# EAGLE schematic LEDPanel (EAGLE 9.6.2)
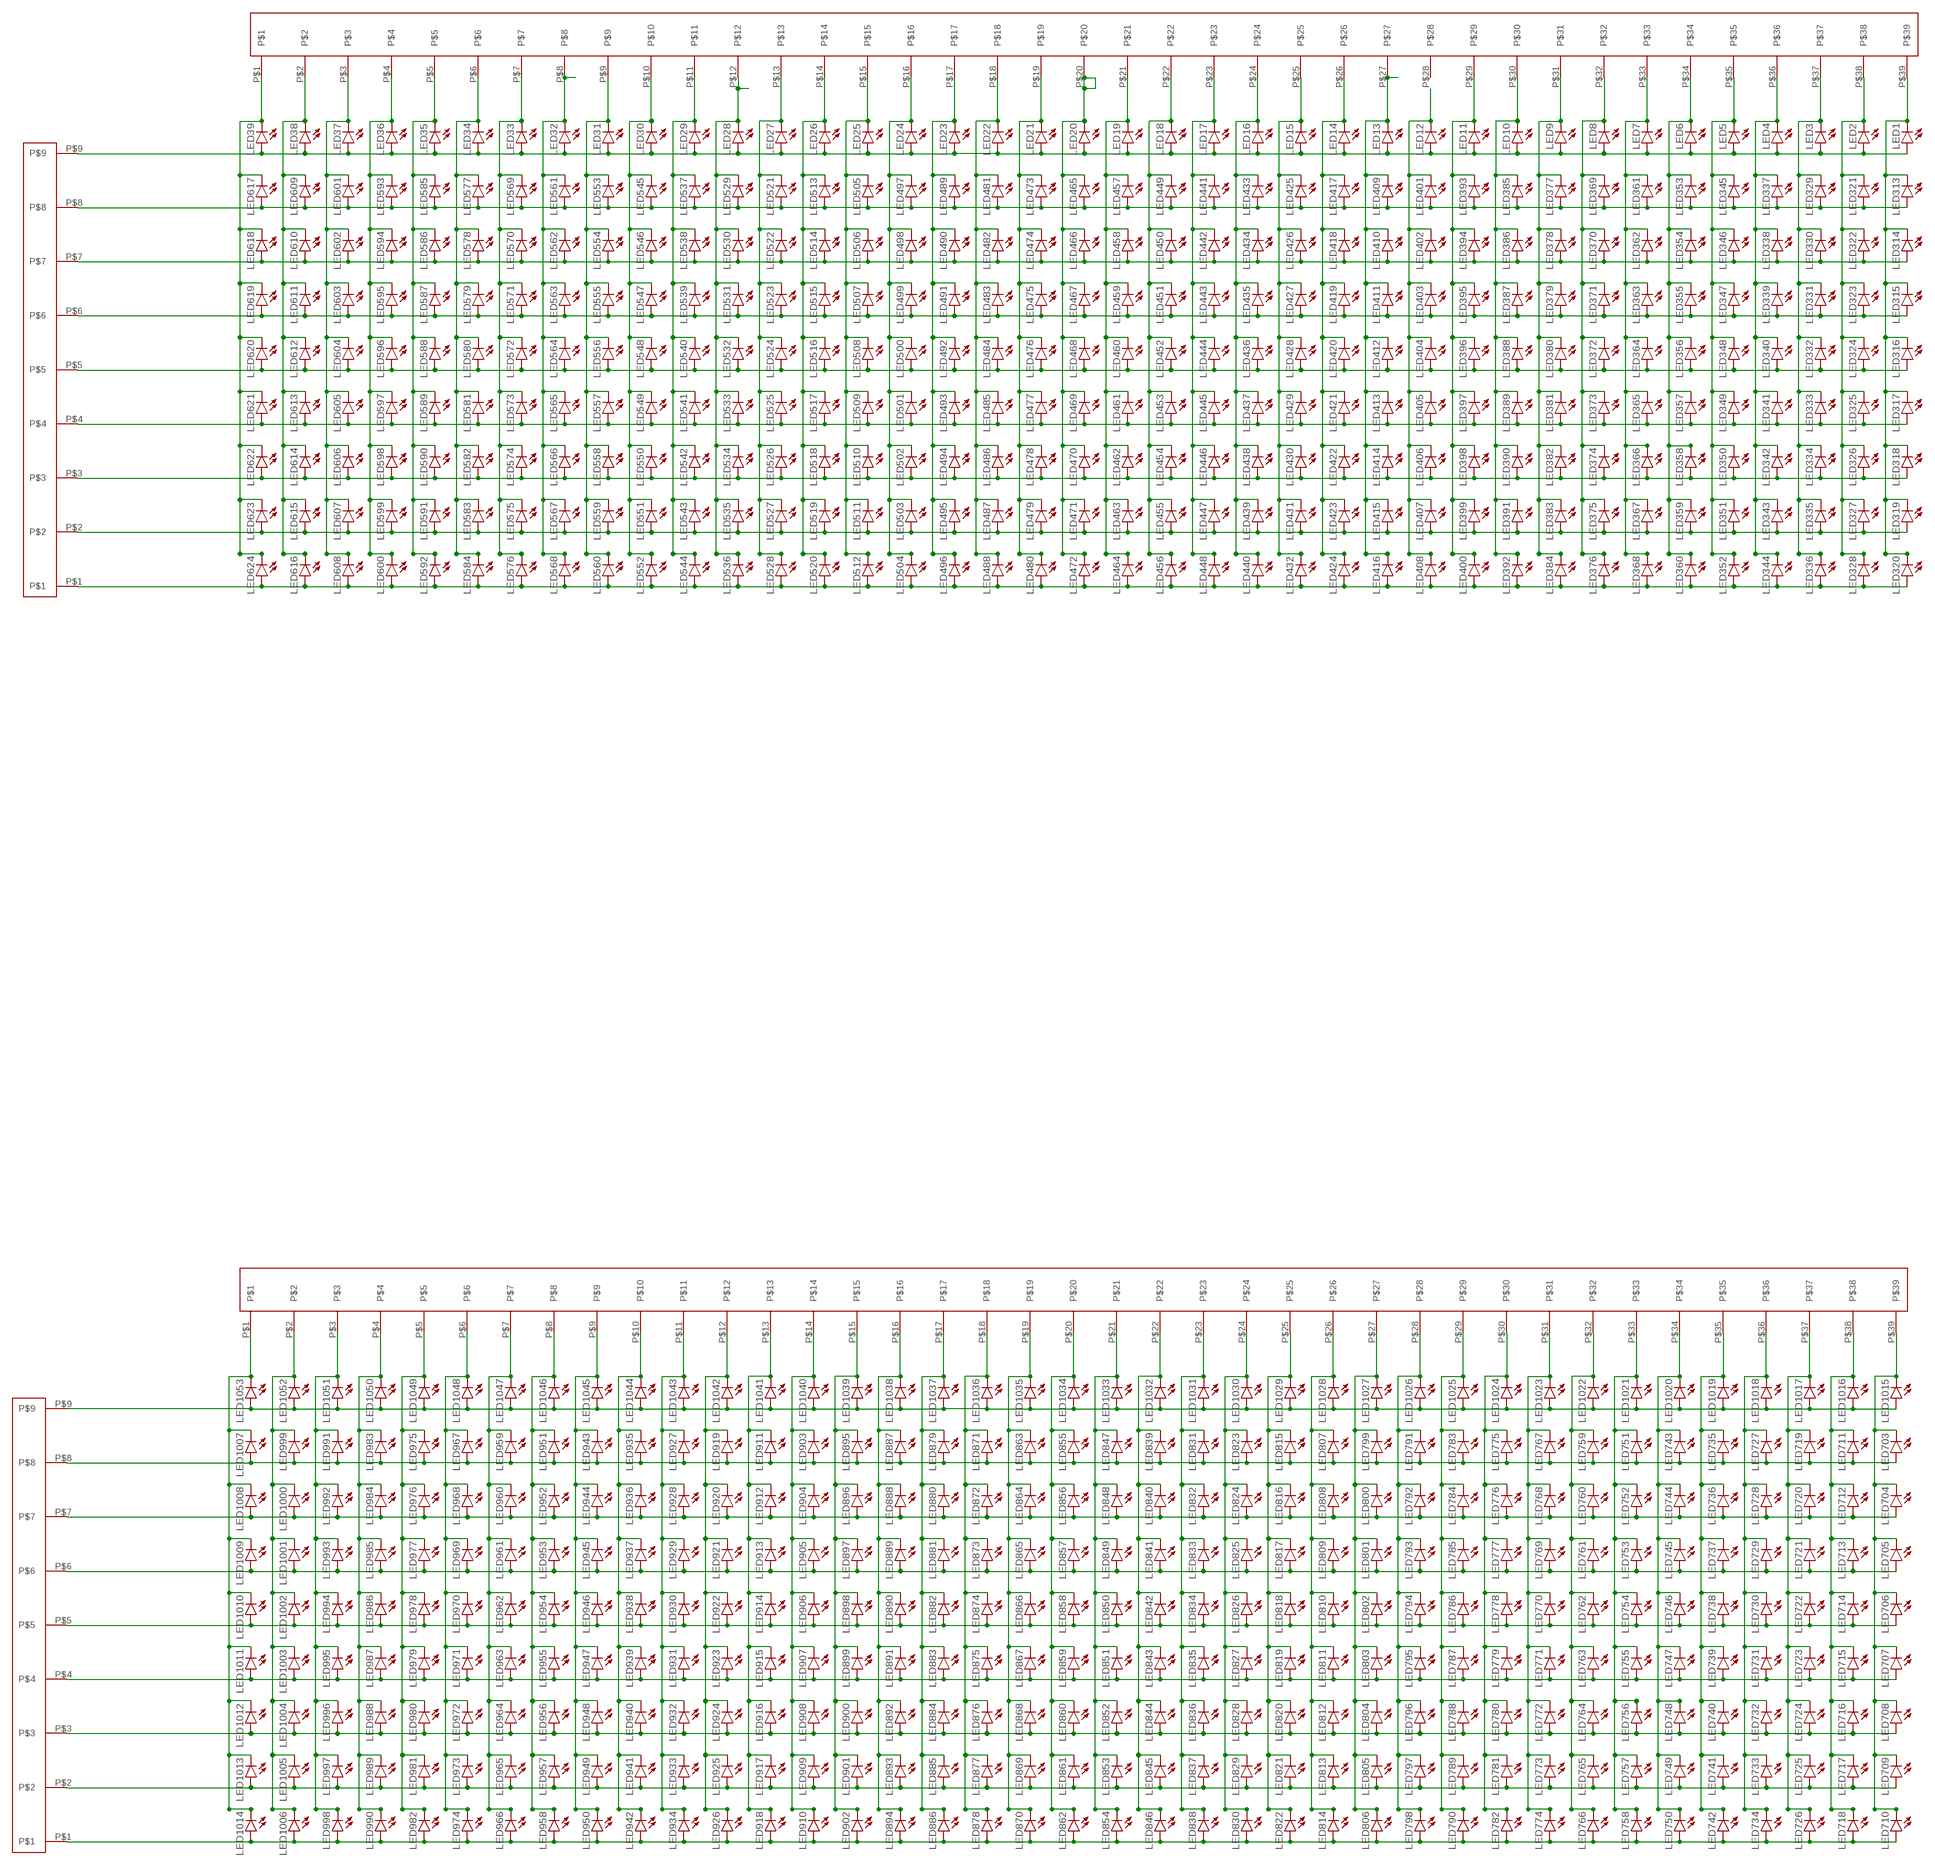
[diagram p0: schematic, sheet 1]

## Parts
LED1  LED3MM  [LED_3MM]
LED2  LED3MM  [LED_3MM]
LED3  LED3MM  [LED_3MM]
LED4  LED3MM  [LED_3MM]
LED5  LED3MM  [LED_3MM]
LED6  LED3MM  [LED_3MM]
LED7  LED3MM  [LED_3MM]
LED8  LED3MM  [LED_3MM]
LED9  LED3MM  [LED_3MM]
LED10  LED3MM  [LED_3MM]
LED11  LED3MM  [LED_3MM]
LED12  LED3MM  [LED_3MM]
LED13  LED3MM  [LED_3MM]
LED14  LED3MM  [LED_3MM]
LED15  LED3MM  [LED_3MM]
LED16  LED3MM  [LED_3MM]
LED17  LED3MM  [LED_3MM]
LED18  LED3MM  [LED_3MM]
LED19  LED3MM  [LED_3MM]
LED20  LED3MM  [LED_3MM]
LED21  LED3MM  [LED_3MM]
LED22  LED3MM  [LED_3MM]
LED23  LED3MM  [LED_3MM]
LED24  LED3MM  [LED_3MM]
LED25  LED3MM  [LED_3MM]
LED26  LED3MM  [LED_3MM]
LED27  LED3MM  [LED_3MM]
LED28  LED3MM  [LED_3MM]
LED29  LED3MM  [LED_3MM]
LED30  LED3MM  [LED_3MM]
LED31  LED3MM  [LED_3MM]
LED32  LED3MM  [LED_3MM]
LED33  LED3MM  [LED_3MM]
LED34  LED3MM  [LED_3MM]
LED35  LED3MM  [LED_3MM]
LED36  LED3MM  [LED_3MM]
LED37  LED3MM  [LED_3MM]
LED38  LED3MM  [LED_3MM]
LED39  LED3MM  [LED_3MM]
LED313  LED3MM  [LED_3MM]
LED314  LED3MM  [LED_3MM]
LED315  LED3MM  [LED_3MM]
LED316  LED3MM  [LED_3MM]
LED317  LED3MM  [LED_3MM]
LED318  LED3MM  [LED_3MM]
LED319  LED3MM  [LED_3MM]
LED320  LED3MM  [LED_3MM]
LED321  LED3MM  [LED_3MM]
LED322  LED3MM  [LED_3MM]
LED323  LED3MM  [LED_3MM]
LED324  LED3MM  [LED_3MM]
LED325  LED3MM  [LED_3MM]
LED326  LED3MM  [LED_3MM]
LED327  LED3MM  [LED_3MM]
LED328  LED3MM  [LED_3MM]
LED329  LED3MM  [LED_3MM]
LED330  LED3MM  [LED_3MM]
LED331  LED3MM  [LED_3MM]
LED332  LED3MM  [LED_3MM]
LED333  LED3MM  [LED_3MM]
LED334  LED3MM  [LED_3MM]
LED335  LED3MM  [LED_3MM]
LED336  LED3MM  [LED_3MM]
LED337  LED3MM  [LED_3MM]
LED338  LED3MM  [LED_3MM]
LED339  LED3MM  [LED_3MM]
LED340  LED3MM  [LED_3MM]
LED341  LED3MM  [LED_3MM]
LED342  LED3MM  [LED_3MM]
LED343  LED3MM  [LED_3MM]
LED344  LED3MM  [LED_3MM]
LED345  LED3MM  [LED_3MM]
LED346  LED3MM  [LED_3MM]
LED347  LED3MM  [LED_3MM]
LED348  LED3MM  [LED_3MM]
LED349  LED3MM  [LED_3MM]
LED350  LED3MM  [LED_3MM]
LED351  LED3MM  [LED_3MM]
LED352  LED3MM  [LED_3MM]
LED353  LED3MM  [LED_3MM]
LED354  LED3MM  [LED_3MM]
LED355  LED3MM  [LED_3MM]
LED356  LED3MM  [LED_3MM]
LED357  LED3MM  [LED_3MM]
LED358  LED3MM  [LED_3MM]
LED359  LED3MM  [LED_3MM]
LED360  LED3MM  [LED_3MM]
LED361  LED3MM  [LED_3MM]
LED362  LED3MM  [LED_3MM]
LED363  LED3MM  [LED_3MM]
LED364  LED3MM  [LED_3MM]
LED365  LED3MM  [LED_3MM]
LED366  LED3MM  [LED_3MM]
LED367  LED3MM  [LED_3MM]
LED368  LED3MM  [LED_3MM]
LED369  LED3MM  [LED_3MM]
LED370  LED3MM  [LED_3MM]
LED371  LED3MM  [LED_3MM]
LED372  LED3MM  [LED_3MM]
LED373  LED3MM  [LED_3MM]
LED374  LED3MM  [LED_3MM]
LED375  LED3MM  [LED_3MM]
LED376  LED3MM  [LED_3MM]
LED377  LED3MM  [LED_3MM]
LED378  LED3MM  [LED_3MM]
LED379  LED3MM  [LED_3MM]
LED380  LED3MM  [LED_3MM]
LED381  LED3MM  [LED_3MM]
LED382  LED3MM  [LED_3MM]
LED383  LED3MM  [LED_3MM]
LED384  LED3MM  [LED_3MM]
LED385  LED3MM  [LED_3MM]
LED386  LED3MM  [LED_3MM]
LED387  LED3MM  [LED_3MM]
LED388  LED3MM  [LED_3MM]
LED389  LED3MM  [LED_3MM]
LED390  LED3MM  [LED_3MM]
LED391  LED3MM  [LED_3MM]
LED392  LED3MM  [LED_3MM]
LED393  LED3MM  [LED_3MM]
LED394  LED3MM  [LED_3MM]
LED395  LED3MM  [LED_3MM]
LED396  LED3MM  [LED_3MM]
LED397  LED3MM  [LED_3MM]
LED398  LED3MM  [LED_3MM]
LED399  LED3MM  [LED_3MM]
LED400  LED3MM  [LED_3MM]
LED401  LED3MM  [LED_3MM]
LED402  LED3MM  [LED_3MM]
LED403  LED3MM  [LED_3MM]
LED404  LED3MM  [LED_3MM]
LED405  LED3MM  [LED_3MM]
LED406  LED3MM  [LED_3MM]
LED407  LED3MM  [LED_3MM]
LED408  LED3MM  [LED_3MM]
LED409  LED3MM  [LED_3MM]
LED410  LED3MM  [LED_3MM]
LED411  LED3MM  [LED_3MM]
LED412  LED3MM  [LED_3MM]
LED413  LED3MM  [LED_3MM]
LED414  LED3MM  [LED_3MM]
LED415  LED3MM  [LED_3MM]
LED416  LED3MM  [LED_3MM]
LED417  LED3MM  [LED_3MM]
LED418  LED3MM  [LED_3MM]
LED419  LED3MM  [LED_3MM]
LED420  LED3MM  [LED_3MM]
LED421  LED3MM  [LED_3MM]
LED422  LED3MM  [LED_3MM]
LED423  LED3MM  [LED_3MM]
LED424  LED3MM  [LED_3MM]
LED425  LED3MM  [LED_3MM]
LED426  LED3MM  [LED_3MM]
LED427  LED3MM  [LED_3MM]
LED428  LED3MM  [LED_3MM]
LED429  LED3MM  [LED_3MM]
LED430  LED3MM  [LED_3MM]
LED431  LED3MM  [LED_3MM]
LED432  LED3MM  [LED_3MM]
LED433  LED3MM  [LED_3MM]
LED434  LED3MM  [LED_3MM]
LED435  LED3MM  [LED_3MM]
LED436  LED3MM  [LED_3MM]
LED437  LED3MM  [LED_3MM]
LED438  LED3MM  [LED_3MM]
LED439  LED3MM  [LED_3MM]
LED440  LED3MM  [LED_3MM]
LED441  LED3MM  [LED_3MM]
LED442  LED3MM  [LED_3MM]
LED443  LED3MM  [LED_3MM]
LED444  LED3MM  [LED_3MM]
LED445  LED3MM  [LED_3MM]
LED446  LED3MM  [LED_3MM]
LED447  LED3MM  [LED_3MM]
LED448  LED3MM  [LED_3MM]
LED449  LED3MM  [LED_3MM]
LED450  LED3MM  [LED_3MM]
LED451  LED3MM  [LED_3MM]
LED452  LED3MM  [LED_3MM]
LED453  LED3MM  [LED_3MM]
LED454  LED3MM  [LED_3MM]
LED455  LED3MM  [LED_3MM]
LED456  LED3MM  [LED_3MM]
LED457  LED3MM  [LED_3MM]
LED458  LED3MM  [LED_3MM]
LED459  LED3MM  [LED_3MM]
LED460  LED3MM  [LED_3MM]
LED461  LED3MM  [LED_3MM]
LED462  LED3MM  [LED_3MM]
LED463  LED3MM  [LED_3MM]
LED464  LED3MM  [LED_3MM]
LED465  LED3MM  [LED_3MM]
LED466  LED3MM  [LED_3MM]
LED467  LED3MM  [LED_3MM]
LED468  LED3MM  [LED_3MM]
LED469  LED3MM  [LED_3MM]
LED470  LED3MM  [LED_3MM]
LED471  LED3MM  [LED_3MM]
LED472  LED3MM  [LED_3MM]
LED473  LED3MM  [LED_3MM]
LED474  LED3MM  [LED_3MM]
LED475  LED3MM  [LED_3MM]
LED476  LED3MM  [LED_3MM]
LED477  LED3MM  [LED_3MM]
LED478  LED3MM  [LED_3MM]
LED479  LED3MM  [LED_3MM]
LED480  LED3MM  [LED_3MM]
LED481  LED3MM  [LED_3MM]
LED482  LED3MM  [LED_3MM]
LED483  LED3MM  [LED_3MM]
LED484  LED3MM  [LED_3MM]
LED485  LED3MM  [LED_3MM]
LED486  LED3MM  [LED_3MM]
LED487  LED3MM  [LED_3MM]
LED488  LED3MM  [LED_3MM]
LED489  LED3MM  [LED_3MM]
LED490  LED3MM  [LED_3MM]
LED491  LED3MM  [LED_3MM]
LED492  LED3MM  [LED_3MM]
LED493  LED3MM  [LED_3MM]
LED494  LED3MM  [LED_3MM]
LED495  LED3MM  [LED_3MM]
LED496  LED3MM  [LED_3MM]
LED497  LED3MM  [LED_3MM]
LED498  LED3MM  [LED_3MM]
LED499  LED3MM  [LED_3MM]
LED500  LED3MM  [LED_3MM]
LED501  LED3MM  [LED_3MM]
LED502  LED3MM  [LED_3MM]
LED503  LED3MM  [LED_3MM]
LED504  LED3MM  [LED_3MM]
LED505  LED3MM  [LED_3MM]
LED506  LED3MM  [LED_3MM]
LED507  LED3MM  [LED_3MM]
LED508  LED3MM  [LED_3MM]
LED509  LED3MM  [LED_3MM]
LED510  LED3MM  [LED_3MM]
LED511  LED3MM  [LED_3MM]
LED512  LED3MM  [LED_3MM]
LED513  LED3MM  [LED_3MM]
LED514  LED3MM  [LED_3MM]
LED515  LED3MM  [LED_3MM]
LED516  LED3MM  [LED_3MM]
LED517  LED3MM  [LED_3MM]
LED518  LED3MM  [LED_3MM]
LED519  LED3MM  [LED_3MM]
LED520  LED3MM  [LED_3MM]
LED521  LED3MM  [LED_3MM]
LED522  LED3MM  [LED_3MM]
LED523  LED3MM  [LED_3MM]
LED524  LED3MM  [LED_3MM]
LED525  LED3MM  [LED_3MM]
LED526  LED3MM  [LED_3MM]
LED527  LED3MM  [LED_3MM]
LED528  LED3MM  [LED_3MM]
LED529  LED3MM  [LED_3MM]
LED530  LED3MM  [LED_3MM]
LED531  LED3MM  [LED_3MM]
LED532  LED3MM  [LED_3MM]
LED533  LED3MM  [LED_3MM]
LED534  LED3MM  [LED_3MM]
LED535  LED3MM  [LED_3MM]
LED536  LED3MM  [LED_3MM]
LED537  LED3MM  [LED_3MM]
LED538  LED3MM  [LED_3MM]
LED539  LED3MM  [LED_3MM]
LED540  LED3MM  [LED_3MM]
LED541  LED3MM  [LED_3MM]
LED542  LED3MM  [LED_3MM]
LED543  LED3MM  [LED_3MM]
LED544  LED3MM  [LED_3MM]
LED545  LED3MM  [LED_3MM]
LED546  LED3MM  [LED_3MM]
LED547  LED3MM  [LED_3MM]
LED548  LED3MM  [LED_3MM]
LED549  LED3MM  [LED_3MM]
LED550  LED3MM  [LED_3MM]
LED551  LED3MM  [LED_3MM]
LED552  LED3MM  [LED_3MM]
LED553  LED3MM  [LED_3MM]
LED554  LED3MM  [LED_3MM]
LED555  LED3MM  [LED_3MM]
LED556  LED3MM  [LED_3MM]
LED557  LED3MM  [LED_3MM]
LED558  LED3MM  [LED_3MM]
LED559  LED3MM  [LED_3MM]
LED560  LED3MM  [LED_3MM]
LED561  LED3MM  [LED_3MM]
LED562  LED3MM  [LED_3MM]
LED563  LED3MM  [LED_3MM]
LED564  LED3MM  [LED_3MM]
LED565  LED3MM  [LED_3MM]
LED566  LED3MM  [LED_3MM]
LED567  LED3MM  [LED_3MM]
LED568  LED3MM  [LED_3MM]
LED569  LED3MM  [LED_3MM]
LED570  LED3MM  [LED_3MM]
LED571  LED3MM  [LED_3MM]
LED572  LED3MM  [LED_3MM]
LED573  LED3MM  [LED_3MM]
LED574  LED3MM  [LED_3MM]
LED575  LED3MM  [LED_3MM]
LED576  LED3MM  [LED_3MM]
LED577  LED3MM  [LED_3MM]
LED578  LED3MM  [LED_3MM]
LED579  LED3MM  [LED_3MM]
LED580  LED3MM  [LED_3MM]
LED581  LED3MM  [LED_3MM]
LED582  LED3MM  [LED_3MM]
LED583  LED3MM  [LED_3MM]
LED584  LED3MM  [LED_3MM]
LED585  LED3MM  [LED_3MM]
LED586  LED3MM  [LED_3MM]
LED587  LED3MM  [LED_3MM]
LED588  LED3MM  [LED_3MM]
LED589  LED3MM  [LED_3MM]
LED590  LED3MM  [LED_3MM]
LED591  LED3MM  [LED_3MM]
LED592  LED3MM  [LED_3MM]
LED593  LED3MM  [LED_3MM]
LED594  LED3MM  [LED_3MM]
LED595  LED3MM  [LED_3MM]
LED596  LED3MM  [LED_3MM]
LED597  LED3MM  [LED_3MM]
LED598  LED3MM  [LED_3MM]
LED599  LED3MM  [LED_3MM]
LED600  LED3MM  [LED_3MM]
LED601  LED3MM  [LED_3MM]
LED602  LED3MM  [LED_3MM]
LED603  LED3MM  [LED_3MM]
LED604  LED3MM  [LED_3MM]
LED605  LED3MM  [LED_3MM]
LED606  LED3MM  [LED_3MM]
LED607  LED3MM  [LED_3MM]
LED608  LED3MM  [LED_3MM]
LED609  LED3MM  [LED_3MM]
LED610  LED3MM  [LED_3MM]
LED611  LED3MM  [LED_3MM]
LED612  LED3MM  [LED_3MM]
LED613  LED3MM  [LED_3MM]
LED614  LED3MM  [LED_3MM]
LED615  LED3MM  [LED_3MM]
LED616  LED3MM  [LED_3MM]
LED617  LED3MM  [LED_3MM]
LED618  LED3MM  [LED_3MM]
LED619  LED3MM  [LED_3MM]
LED620  LED3MM  [LED_3MM]
LED621  LED3MM  [LED_3MM]
LED622  LED3MM  [LED_3MM]
LED623  LED3MM  [LED_3MM]
LED624  LED3MM  [LED_3MM]
LED703  LED3MM  [LED_3MM]
LED704  LED3MM  [LED_3MM]
LED705  LED3MM  [LED_3MM]
LED706  LED3MM  [LED_3MM]
LED707  LED3MM  [LED_3MM]
LED708  LED3MM  [LED_3MM]
LED709  LED3MM  [LED_3MM]
LED710  LED3MM  [LED_3MM]
LED711  LED3MM  [LED_3MM]
LED712  LED3MM  [LED_3MM]
LED713  LED3MM  [LED_3MM]
LED714  LED3MM  [LED_3MM]
LED715  LED3MM  [LED_3MM]
LED716  LED3MM  [LED_3MM]
LED717  LED3MM  [LED_3MM]
LED718  LED3MM  [LED_3MM]
LED719  LED3MM  [LED_3MM]
LED720  LED3MM  [LED_3MM]
LED721  LED3MM  [LED_3MM]
LED722  LED3MM  [LED_3MM]
LED723  LED3MM  [LED_3MM]
LED724  LED3MM  [LED_3MM]
LED725  LED3MM  [LED_3MM]
LED726  LED3MM  [LED_3MM]
LED727  LED3MM  [LED_3MM]
LED728  LED3MM  [LED_3MM]
LED729  LED3MM  [LED_3MM]
LED730  LED3MM  [LED_3MM]
LED731  LED3MM  [LED_3MM]
LED732  LED3MM  [LED_3MM]
LED733  LED3MM  [LED_3MM]
LED734  LED3MM  [LED_3MM]
LED735  LED3MM  [LED_3MM]
LED736  LED3MM  [LED_3MM]
LED737  LED3MM  [LED_3MM]
LED738  LED3MM  [LED_3MM]
LED739  LED3MM  [LED_3MM]
LED740  LED3MM  [LED_3MM]
LED741  LED3MM  [LED_3MM]
LED742  LED3MM  [LED_3MM]
LED743  LED3MM  [LED_3MM]
LED744  LED3MM  [LED_3MM]
LED745  LED3MM  [LED_3MM]
LED746  LED3MM  [LED_3MM]
LED747  LED3MM  [LED_3MM]
LED748  LED3MM  [LED_3MM]
LED749  LED3MM  [LED_3MM]
LED750  LED3MM  [LED_3MM]
LED751  LED3MM  [LED_3MM]
LED752  LED3MM  [LED_3MM]
LED753  LED3MM  [LED_3MM]
LED754  LED3MM  [LED_3MM]
LED755  LED3MM  [LED_3MM]
LED756  LED3MM  [LED_3MM]
LED757  LED3MM  [LED_3MM]
LED758  LED3MM  [LED_3MM]
LED759  LED3MM  [LED_3MM]
LED760  LED3MM  [LED_3MM]
LED761  LED3MM  [LED_3MM]
LED762  LED3MM  [LED_3MM]
LED763  LED3MM  [LED_3MM]
LED764  LED3MM  [LED_3MM]
LED765  LED3MM  [LED_3MM]
LED766  LED3MM  [LED_3MM]
LED767  LED3MM  [LED_3MM]
LED768  LED3MM  [LED_3MM]
LED769  LED3MM  [LED_3MM]
LED770  LED3MM  [LED_3MM]
LED771  LED3MM  [LED_3MM]
LED772  LED3MM  [LED_3MM]
LED773  LED3MM  [LED_3MM]
LED774  LED3MM  [LED_3MM]
LED775  LED3MM  [LED_3MM]
LED776  LED3MM  [LED_3MM]
LED777  LED3MM  [LED_3MM]
LED778  LED3MM  [LED_3MM]
LED779  LED3MM  [LED_3MM]
LED780  LED3MM  [LED_3MM]
LED781  LED3MM  [LED_3MM]
LED782  LED3MM  [LED_3MM]
LED783  LED3MM  [LED_3MM]
LED784  LED3MM  [LED_3MM]
LED785  LED3MM  [LED_3MM]
LED786  LED3MM  [LED_3MM]
LED787  LED3MM  [LED_3MM]
LED788  LED3MM  [LED_3MM]
LED789  LED3MM  [LED_3MM]
LED790  LED3MM  [LED_3MM]
LED791  LED3MM  [LED_3MM]
LED792  LED3MM  [LED_3MM]
LED793  LED3MM  [LED_3MM]
LED794  LED3MM  [LED_3MM]
LED795  LED3MM  [LED_3MM]
LED796  LED3MM  [LED_3MM]
LED797  LED3MM  [LED_3MM]
LED798  LED3MM  [LED_3MM]
LED799  LED3MM  [LED_3MM]
LED800  LED3MM  [LED_3MM]
LED801  LED3MM  [LED_3MM]
LED802  LED3MM  [LED_3MM]
LED803  LED3MM  [LED_3MM]
LED804  LED3MM  [LED_3MM]
LED805  LED3MM  [LED_3MM]
LED806  LED3MM  [LED_3MM]
LED807  LED3MM  [LED_3MM]
LED808  LED3MM  [LED_3MM]
LED809  LED3MM  [LED_3MM]
LED810  LED3MM  [LED_3MM]
LED811  LED3MM  [LED_3MM]
LED812  LED3MM  [LED_3MM]
LED813  LED3MM  [LED_3MM]
LED814  LED3MM  [LED_3MM]
LED815  LED3MM  [LED_3MM]
LED816  LED3MM  [LED_3MM]
LED817  LED3MM  [LED_3MM]
LED818  LED3MM  [LED_3MM]
LED819  LED3MM  [LED_3MM]
LED820  LED3MM  [LED_3MM]
LED821  LED3MM  [LED_3MM]
LED822  LED3MM  [LED_3MM]
LED823  LED3MM  [LED_3MM]
LED824  LED3MM  [LED_3MM]
LED825  LED3MM  [LED_3MM]
LED826  LED3MM  [LED_3MM]
LED827  LED3MM  [LED_3MM]
LED828  LED3MM  [LED_3MM]
LED829  LED3MM  [LED_3MM]
LED830  LED3MM  [LED_3MM]
LED831  LED3MM  [LED_3MM]
LED832  LED3MM  [LED_3MM]
LED833  LED3MM  [LED_3MM]
LED834  LED3MM  [LED_3MM]
LED835  LED3MM  [LED_3MM]
LED836  LED3MM  [LED_3MM]
LED837  LED3MM  [LED_3MM]
LED838  LED3MM  [LED_3MM]
LED839  LED3MM  [LED_3MM]
LED840  LED3MM  [LED_3MM]
LED841  LED3MM  [LED_3MM]
LED842  LED3MM  [LED_3MM]
LED843  LED3MM  [LED_3MM]
LED844  LED3MM  [LED_3MM]
LED845  LED3MM  [LED_3MM]
LED846  LED3MM  [LED_3MM]
LED847  LED3MM  [LED_3MM]
LED848  LED3MM  [LED_3MM]
LED849  LED3MM  [LED_3MM]
LED850  LED3MM  [LED_3MM]
LED851  LED3MM  [LED_3MM]
LED852  LED3MM  [LED_3MM]
LED853  LED3MM  [LED_3MM]
LED854  LED3MM  [LED_3MM]
LED855  LED3MM  [LED_3MM]
LED856  LED3MM  [LED_3MM]
LED857  LED3MM  [LED_3MM]
LED858  LED3MM  [LED_3MM]
LED859  LED3MM  [LED_3MM]
LED860  LED3MM  [LED_3MM]
LED861  LED3MM  [LED_3MM]
LED862  LED3MM  [LED_3MM]
LED863  LED3MM  [LED_3MM]
LED864  LED3MM  [LED_3MM]
LED865  LED3MM  [LED_3MM]
LED866  LED3MM  [LED_3MM]
LED867  LED3MM  [LED_3MM]
LED868  LED3MM  [LED_3MM]
LED869  LED3MM  [LED_3MM]
LED870  LED3MM  [LED_3MM]
LED871  LED3MM  [LED_3MM]
LED872  LED3MM  [LED_3MM]
LED873  LED3MM  [LED_3MM]
LED874  LED3MM  [LED_3MM]
LED875  LED3MM  [LED_3MM]
LED876  LED3MM  [LED_3MM]
LED877  LED3MM  [LED_3MM]
LED878  LED3MM  [LED_3MM]
LED879  LED3MM  [LED_3MM]
LED880  LED3MM  [LED_3MM]
LED881  LED3MM  [LED_3MM]
LED882  LED3MM  [LED_3MM]
LED883  LED3MM  [LED_3MM]
LED884  LED3MM  [LED_3MM]
LED885  LED3MM  [LED_3MM]
LED886  LED3MM  [LED_3MM]
LED887  LED3MM  [LED_3MM]
LED888  LED3MM  [LED_3MM]
LED889  LED3MM  [LED_3MM]
LED890  LED3MM  [LED_3MM]
LED891  LED3MM  [LED_3MM]
LED892  LED3MM  [LED_3MM]
LED893  LED3MM  [LED_3MM]
LED894  LED3MM  [LED_3MM]
LED895  LED3MM  [LED_3MM]
LED896  LED3MM  [LED_3MM]
LED897  LED3MM  [LED_3MM]
LED898  LED3MM  [LED_3MM]
LED899  LED3MM  [LED_3MM]
LED900  LED3MM  [LED_3MM]
LED901  LED3MM  [LED_3MM]
LED902  LED3MM  [LED_3MM]
LED903  LED3MM  [LED_3MM]
LED904  LED3MM  [LED_3MM]
LED905  LED3MM  [LED_3MM]
LED906  LED3MM  [LED_3MM]
LED907  LED3MM  [LED_3MM]
LED908  LED3MM  [LED_3MM]
LED909  LED3MM  [LED_3MM]
LED910  LED3MM  [LED_3MM]
LED911  LED3MM  [LED_3MM]
LED912  LED3MM  [LED_3MM]
LED913  LED3MM  [LED_3MM]
LED914  LED3MM  [LED_3MM]
LED915  LED3MM  [LED_3MM]
LED916  LED3MM  [LED_3MM]
LED917  LED3MM  [LED_3MM]
LED918  LED3MM  [LED_3MM]
LED919  LED3MM  [LED_3MM]
LED920  LED3MM  [LED_3MM]
LED921  LED3MM  [LED_3MM]
LED922  LED3MM  [LED_3MM]
LED923  LED3MM  [LED_3MM]
LED924  LED3MM  [LED_3MM]
LED925  LED3MM  [LED_3MM]
LED926  LED3MM  [LED_3MM]
LED927  LED3MM  [LED_3MM]
LED928  LED3MM  [LED_3MM]
LED929  LED3MM  [LED_3MM]
LED930  LED3MM  [LED_3MM]
LED931  LED3MM  [LED_3MM]
LED932  LED3MM  [LED_3MM]
LED933  LED3MM  [LED_3MM]
LED934  LED3MM  [LED_3MM]
LED935  LED3MM  [LED_3MM]
LED936  LED3MM  [LED_3MM]
LED937  LED3MM  [LED_3MM]
LED938  LED3MM  [LED_3MM]
LED939  LED3MM  [LED_3MM]
LED940  LED3MM  [LED_3MM]
LED941  LED3MM  [LED_3MM]
LED942  LED3MM  [LED_3MM]
LED943  LED3MM  [LED_3MM]
LED944  LED3MM  [LED_3MM]
LED945  LED3MM  [LED_3MM]
LED946  LED3MM  [LED_3MM]
LED947  LED3MM  [LED_3MM]
LED948  LED3MM  [LED_3MM]
LED949  LED3MM  [LED_3MM]
LED950  LED3MM  [LED_3MM]
LED951  LED3MM  [LED_3MM]
LED952  LED3MM  [LED_3MM]
LED953  LED3MM  [LED_3MM]
LED954  LED3MM  [LED_3MM]
LED955  LED3MM  [LED_3MM]
LED956  LED3MM  [LED_3MM]
LED957  LED3MM  [LED_3MM]
LED958  LED3MM  [LED_3MM]
LED959  LED3MM  [LED_3MM]
LED960  LED3MM  [LED_3MM]
LED961  LED3MM  [LED_3MM]
LED962  LED3MM  [LED_3MM]
LED963  LED3MM  [LED_3MM]
LED964  LED3MM  [LED_3MM]
LED965  LED3MM  [LED_3MM]
LED966  LED3MM  [LED_3MM]
LED967  LED3MM  [LED_3MM]
LED968  LED3MM  [LED_3MM]
LED969  LED3MM  [LED_3MM]
LED970  LED3MM  [LED_3MM]
LED971  LED3MM  [LED_3MM]
LED972  LED3MM  [LED_3MM]
LED973  LED3MM  [LED_3MM]
LED974  LED3MM  [LED_3MM]
LED975  LED3MM  [LED_3MM]
LED976  LED3MM  [LED_3MM]
LED977  LED3MM  [LED_3MM]
LED978  LED3MM  [LED_3MM]
LED979  LED3MM  [LED_3MM]
LED980  LED3MM  [LED_3MM]
LED981  LED3MM  [LED_3MM]
LED982  LED3MM  [LED_3MM]
LED983  LED3MM  [LED_3MM]
LED984  LED3MM  [LED_3MM]
LED985  LED3MM  [LED_3MM]
LED986  LED3MM  [LED_3MM]
LED987  LED3MM  [LED_3MM]
LED988  LED3MM  [LED_3MM]
LED989  LED3MM  [LED_3MM]
LED990  LED3MM  [LED_3MM]
LED991  LED3MM  [LED_3MM]
LED992  LED3MM  [LED_3MM]
LED993  LED3MM  [LED_3MM]
LED994  LED3MM  [LED_3MM]
LED995  LED3MM  [LED_3MM]
LED996  LED3MM  [LED_3MM]
LED997  LED3MM  [LED_3MM]
LED998  LED3MM  [LED_3MM]
LED999  LED3MM  [LED_3MM]
LED1000  LED3MM  [LED_3MM]
LED1001  LED3MM  [LED_3MM]
LED1002  LED3MM  [LED_3MM]
LED1003  LED3MM  [LED_3MM]
LED1004  LED3MM  [LED_3MM]
LED1005  LED3MM  [LED_3MM]
LED1006  LED3MM  [LED_3MM]
LED1007  LED3MM  [LED_3MM]
LED1008  LED3MM  [LED_3MM]
LED1009  LED3MM  [LED_3MM]
LED1010  LED3MM  [LED_3MM]
LED1011  LED3MM  [LED_3MM]
LED1012  LED3MM  [LED_3MM]
LED1013  LED3MM  [LED_3MM]
LED1014  LED3MM  [LED_3MM]
LED1015  LED3MM  [LED_3MM]
LED1016  LED3MM  [LED_3MM]
LED1017  LED3MM  [LED_3MM]
LED1018  LED3MM  [LED_3MM]
LED1019  LED3MM  [LED_3MM]
LED1020  LED3MM  [LED_3MM]
LED1021  LED3MM  [LED_3MM]
LED1022  LED3MM  [LED_3MM]
LED1023  LED3MM  [LED_3MM]
LED1024  LED3MM  [LED_3MM]
LED1025  LED3MM  [LED_3MM]
LED1026  LED3MM  [LED_3MM]
LED1027  LED3MM  [LED_3MM]
LED1028  LED3MM  [LED_3MM]
LED1029  LED3MM  [LED_3MM]
LED1030  LED3MM  [LED_3MM]
LED1031  LED3MM  [LED_3MM]
LED1032  LED3MM  [LED_3MM]
LED1033  LED3MM  [LED_3MM]
LED1034  LED3MM  [LED_3MM]
LED1035  LED3MM  [LED_3MM]
LED1036  LED3MM  [LED_3MM]
LED1037  LED3MM  [LED_3MM]
LED1038  LED3MM  [LED_3MM]
LED1039  LED3MM  [LED_3MM]
LED1040  LED3MM  [LED_3MM]
LED1041  LED3MM  [LED_3MM]
LED1042  LED3MM  [LED_3MM]
LED1043  LED3MM  [LED_3MM]
LED1044  LED3MM  [LED_3MM]
LED1045  LED3MM  [LED_3MM]
LED1046  LED3MM  [LED_3MM]
LED1047  LED3MM  [LED_3MM]
LED1048  LED3MM  [LED_3MM]
LED1049  LED3MM  [LED_3MM]
LED1050  LED3MM  [LED_3MM]
LED1051  LED3MM  [LED_3MM]
LED1052  LED3MM  [LED_3MM]
LED1053  LED3MM  [LED_3MM]
U$1  39COLUMN  [COLUMNS]
U$2  39COLUMN  [COLUMNS]
U$3  9ROW  [ROWS]
U$4  9ROW  [ROWS]

## Nets
N$1: LED1.A LED2.A LED3.A LED4.A LED5.A LED6.A LED7.A LED8.A LED9.A LED10.A LED11.A LED12.A LED13.A LED14.A LED15.A LED16.A LED17.A LED18.A LED19.A LED20.A LED21.A LED22.A LED23.A LED24.A LED25.A LED26.A LED27.A LED28.A LED29.A LED30.A LED31.A LED32.A LED33.A LED34.A LED35.A LED36.A LED37.A LED38.A LED39.A U$4.P$9
N$2: LED1.K(C) LED313.K(C) LED314.K(C) LED315.K(C) LED316.K(C) LED317.K(C) LED318.K(C) LED319.K(C) LED320.K(C) U$1.P$39
N$3: LED8.K(C) LED369.K(C) LED370.K(C) LED371.K(C) LED372.K(C) LED373.K(C) LED374.K(C) LED375.K(C) LED376.K(C) U$1.P$32
N$4: LED10.K(C) LED385.K(C) LED386.K(C) LED387.K(C) LED388.K(C) LED389.K(C) LED390.K(C) LED391.K(C) LED392.K(C) U$1.P$30
N$50: LED1007.K(C) LED1008.K(C) LED1009.K(C) LED1010.K(C) LED1011.K(C) LED1012.K(C) LED1013.K(C) LED1014.K(C) LED1053.K(C) U$2.P$1
N$51: LED999.K(C) LED1000.K(C) LED1001.K(C) LED1002.K(C) LED1003.K(C) LED1004.K(C) LED1005.K(C) LED1006.K(C) LED1052.K(C) U$2.P$2
N$52: LED991.K(C) LED992.K(C) LED993.K(C) LED994.K(C) LED995.K(C) LED996.K(C) LED997.K(C) LED998.K(C) LED1051.K(C) U$2.P$3
N$53: LED983.K(C) LED984.K(C) LED985.K(C) LED986.K(C) LED987.K(C) LED988.K(C) LED989.K(C) LED990.K(C) LED1050.K(C) U$2.P$4
N$54: LED975.K(C) LED976.K(C) LED977.K(C) LED978.K(C) LED979.K(C) LED980.K(C) LED981.K(C) LED982.K(C) LED1049.K(C) U$2.P$5
N$55: LED967.K(C) LED968.K(C) LED969.K(C) LED970.K(C) LED971.K(C) LED972.K(C) LED973.K(C) LED974.K(C) LED1048.K(C) U$2.P$6
N$56: LED959.K(C) LED960.K(C) LED961.K(C) LED962.K(C) LED963.K(C) LED964.K(C) LED965.K(C) LED966.K(C) LED1047.K(C) U$2.P$7
N$57: LED951.K(C) LED952.K(C) LED953.K(C) LED954.K(C) LED955.K(C) LED956.K(C) LED957.K(C) LED958.K(C) LED1046.K(C) U$2.P$8
N$58: LED943.K(C) LED944.K(C) LED945.K(C) LED946.K(C) LED947.K(C) LED948.K(C) LED949.K(C) LED950.K(C) LED1045.K(C) U$2.P$9
N$59: LED935.K(C) LED936.K(C) LED937.K(C) LED938.K(C) LED939.K(C) LED940.K(C) LED941.K(C) LED942.K(C) LED1044.K(C) U$2.P$10
N$60: LED927.K(C) LED928.K(C) LED929.K(C) LED930.K(C) LED931.K(C) LED932.K(C) LED933.K(C) LED934.K(C) LED1043.K(C) U$2.P$11
N$61: LED919.K(C) LED920.K(C) LED921.K(C) LED922.K(C) LED923.K(C) LED924.K(C) LED925.K(C) LED926.K(C) LED1042.K(C) U$2.P$12
N$62: LED911.K(C) LED912.K(C) LED913.K(C) LED914.K(C) LED915.K(C) LED916.K(C) LED917.K(C) LED918.K(C) LED1041.K(C) U$2.P$13
N$63: LED903.K(C) LED904.K(C) LED905.K(C) LED906.K(C) LED907.K(C) LED908.K(C) LED909.K(C) LED910.K(C) LED1040.K(C) U$2.P$14
N$64: LED895.K(C) LED896.K(C) LED897.K(C) LED898.K(C) LED899.K(C) LED900.K(C) LED901.K(C) LED902.K(C) LED1039.K(C) U$2.P$15
N$65: LED887.K(C) LED888.K(C) LED889.K(C) LED890.K(C) LED891.K(C) LED892.K(C) LED893.K(C) LED894.K(C) LED1038.K(C) U$2.P$16
N$66: LED879.K(C) LED880.K(C) LED881.K(C) LED882.K(C) LED883.K(C) LED884.K(C) LED885.K(C) LED886.K(C) LED1037.K(C) U$2.P$17
N$67: LED871.K(C) LED872.K(C) LED873.K(C) LED874.K(C) LED875.K(C) LED876.K(C) LED877.K(C) LED878.K(C) LED1036.K(C) U$2.P$18
N$68: LED863.K(C) LED864.K(C) LED865.K(C) LED866.K(C) LED867.K(C) LED868.K(C) LED869.K(C) LED870.K(C) LED1035.K(C) U$2.P$19
N$69: LED855.K(C) LED856.K(C) LED857.K(C) LED858.K(C) LED859.K(C) LED860.K(C) LED861.K(C) LED862.K(C) LED1034.K(C) U$2.P$20
N$70: LED847.K(C) LED848.K(C) LED849.K(C) LED850.K(C) LED851.K(C) LED852.K(C) LED853.K(C) LED854.K(C) LED1033.K(C) U$2.P$21
N$71: LED839.K(C) LED840.K(C) LED841.K(C) LED842.K(C) LED843.K(C) LED844.K(C) LED845.K(C) LED846.K(C) LED1032.K(C) U$2.P$22
N$72: LED831.K(C) LED832.K(C) LED833.K(C) LED834.K(C) LED835.K(C) LED836.K(C) LED837.K(C) LED838.K(C) LED1031.K(C) U$2.P$23
N$73: LED823.K(C) LED824.K(C) LED825.K(C) LED826.K(C) LED827.K(C) LED828.K(C) LED829.K(C) LED830.K(C) LED1030.K(C) U$2.P$24
N$74: LED815.K(C) LED816.K(C) LED817.K(C) LED818.K(C) LED819.K(C) LED820.K(C) LED821.K(C) LED822.K(C) LED1029.K(C) U$2.P$25
N$75: LED807.K(C) LED808.K(C) LED809.K(C) LED810.K(C) LED811.K(C) LED812.K(C) LED813.K(C) LED814.K(C) LED1028.K(C) U$2.P$26
N$76: LED799.K(C) LED800.K(C) LED801.K(C) LED802.K(C) LED803.K(C) LED804.K(C) LED805.K(C) LED806.K(C) LED1027.K(C) U$2.P$27
N$77: LED791.K(C) LED792.K(C) LED793.K(C) LED794.K(C) LED795.K(C) LED796.K(C) LED797.K(C) LED798.K(C) LED1026.K(C) U$2.P$28
N$78: LED783.K(C) LED784.K(C) LED785.K(C) LED786.K(C) LED787.K(C) LED788.K(C) LED789.K(C) LED790.K(C) LED1025.K(C) U$2.P$29
N$79: LED767.K(C) LED768.K(C) LED769.K(C) LED770.K(C) LED771.K(C) LED772.K(C) LED773.K(C) LED774.K(C) LED1023.K(C) U$2.P$31
N$80: LED735.K(C) LED736.K(C) LED737.K(C) LED738.K(C) LED739.K(C) LED740.K(C) LED741.K(C) LED742.K(C) LED1019.K(C) U$2.P$35
N$81: LED727.K(C) LED728.K(C) LED729.K(C) LED730.K(C) LED731.K(C) LED732.K(C) LED733.K(C) LED734.K(C) LED1018.K(C) U$2.P$36
N$82: LED719.K(C) LED720.K(C) LED721.K(C) LED722.K(C) LED723.K(C) LED724.K(C) LED725.K(C) LED726.K(C) LED1017.K(C) U$2.P$37
N$83: LED711.K(C) LED712.K(C) LED713.K(C) LED714.K(C) LED715.K(C) LED716.K(C) LED717.K(C) LED718.K(C) LED1016.K(C) U$2.P$38
N$84: LED39.K(C) LED617.K(C) LED618.K(C) LED619.K(C) LED620.K(C) LED621.K(C) LED622.K(C) LED623.K(C) LED624.K(C) U$1.P$1
N$85: LED38.K(C) LED609.K(C) LED610.K(C) LED611.K(C) LED612.K(C) LED613.K(C) LED614.K(C) LED615.K(C) LED616.K(C) U$1.P$2
N$86: LED37.K(C) LED601.K(C) LED602.K(C) LED603.K(C) LED604.K(C) LED605.K(C) LED606.K(C) LED607.K(C) LED608.K(C) U$1.P$3
N$87: LED36.K(C) LED593.K(C) LED594.K(C) LED595.K(C) LED596.K(C) LED597.K(C) LED598.K(C) LED599.K(C) LED600.K(C) U$1.P$4
N$88: LED35.K(C) LED585.K(C) LED586.K(C) LED587.K(C) LED588.K(C) LED589.K(C) LED590.K(C) LED591.K(C) LED592.K(C) U$1.P$5
N$89: LED34.K(C) LED577.K(C) LED578.K(C) LED579.K(C) LED580.K(C) LED581.K(C) LED582.K(C) LED583.K(C) LED584.K(C) U$1.P$6
N$90: LED33.K(C) LED569.K(C) LED570.K(C) LED571.K(C) LED572.K(C) LED573.K(C) LED574.K(C) LED575.K(C) LED576.K(C) U$1.P$7
N$91: LED32.K(C) LED561.K(C) LED562.K(C) LED563.K(C) LED564.K(C) LED565.K(C) LED566.K(C) LED567.K(C) LED568.K(C) U$1.P$8
N$92: LED31.K(C) LED553.K(C) LED554.K(C) LED555.K(C) LED556.K(C) LED557.K(C) LED558.K(C) LED559.K(C) LED560.K(C) U$1.P$9
N$93: LED30.K(C) LED545.K(C) LED546.K(C) LED547.K(C) LED548.K(C) LED549.K(C) LED550.K(C) LED551.K(C) LED552.K(C) U$1.P$10
N$94: LED29.K(C) LED537.K(C) LED538.K(C) LED539.K(C) LED540.K(C) LED541.K(C) LED542.K(C) LED543.K(C) LED544.K(C) U$1.P$11
N$95: LED28.K(C) LED529.K(C) LED530.K(C) LED531.K(C) LED532.K(C) LED533.K(C) LED534.K(C) LED535.K(C) LED536.K(C) U$1.P$12
N$96: LED27.K(C) LED521.K(C) LED522.K(C) LED523.K(C) LED524.K(C) LED525.K(C) LED526.K(C) LED527.K(C) LED528.K(C) U$1.P$13
N$97: LED26.K(C) LED513.K(C) LED514.K(C) LED515.K(C) LED516.K(C) LED517.K(C) LED518.K(C) LED519.K(C) LED520.K(C) U$1.P$14
N$98: LED25.K(C) LED505.K(C) LED506.K(C) LED507.K(C) LED508.K(C) LED509.K(C) LED510.K(C) LED511.K(C) LED512.K(C) U$1.P$15
N$99: LED24.K(C) LED497.K(C) LED498.K(C) LED499.K(C) LED500.K(C) LED501.K(C) LED502.K(C) LED503.K(C) LED504.K(C) U$1.P$16
N$100: LED23.K(C) LED489.K(C) LED490.K(C) LED491.K(C) LED492.K(C) LED493.K(C) LED494.K(C) LED495.K(C) LED496.K(C) U$1.P$17
N$101: LED22.K(C) LED481.K(C) LED482.K(C) LED483.K(C) LED484.K(C) LED485.K(C) LED486.K(C) LED487.K(C) LED488.K(C) U$1.P$18
N$102: LED21.K(C) LED473.K(C) LED474.K(C) LED475.K(C) LED476.K(C) LED477.K(C) LED478.K(C) LED479.K(C) LED480.K(C) U$1.P$19
N$103: LED20.K(C) LED465.K(C) LED466.K(C) LED467.K(C) LED468.K(C) LED469.K(C) LED470.K(C) LED471.K(C) LED472.K(C) U$1.P$20
N$104: LED19.K(C) LED457.K(C) LED458.K(C) LED459.K(C) LED460.K(C) LED461.K(C) LED462.K(C) LED463.K(C) LED464.K(C) U$1.P$21
N$105: LED18.K(C) LED449.K(C) LED450.K(C) LED451.K(C) LED452.K(C) LED453.K(C) LED454.K(C) LED455.K(C) LED456.K(C) U$1.P$22
N$106: LED17.K(C) LED441.K(C) LED442.K(C) LED443.K(C) LED444.K(C) LED445.K(C) LED446.K(C) LED447.K(C) LED448.K(C) U$1.P$23
N$107: LED16.K(C) LED433.K(C) LED434.K(C) LED435.K(C) LED436.K(C) LED437.K(C) LED438.K(C) LED439.K(C) LED440.K(C) U$1.P$24
N$108: LED15.K(C) LED425.K(C) LED426.K(C) LED427.K(C) LED428.K(C) LED429.K(C) LED430.K(C) LED431.K(C) LED432.K(C) U$1.P$25
N$109: LED14.K(C) LED417.K(C) LED418.K(C) LED419.K(C) LED420.K(C) LED421.K(C) LED422.K(C) LED423.K(C) LED424.K(C) U$1.P$26
N$110: LED13.K(C) LED409.K(C) LED410.K(C) LED411.K(C) LED412.K(C) LED413.K(C) LED414.K(C) LED415.K(C) LED416.K(C) U$1.P$27
N$111: LED12.K(C) LED401.K(C) LED402.K(C) LED403.K(C) LED404.K(C) LED405.K(C) LED406.K(C) LED407.K(C) LED408.K(C)
N$112: LED11.K(C) LED393.K(C) LED394.K(C) LED395.K(C) LED396.K(C) LED397.K(C) LED398.K(C) LED399.K(C) LED400.K(C) U$1.P$29
N$113: LED743.K(C) LED744.K(C) LED745.K(C) LED746.K(C) LED747.K(C) LED748.K(C) LED749.K(C) LED750.K(C) LED1020.K(C) U$2.P$34
N$114: LED9.K(C) LED377.K(C) LED378.K(C) LED379.K(C) LED380.K(C) LED381.K(C) LED382.K(C) LED383.K(C) LED384.K(C) U$1.P$31
N$115: LED751.K(C) LED752.K(C) LED753.K(C) LED754.K(C) LED755.K(C) LED756.K(C) LED757.K(C) LED758.K(C) LED1021.K(C) U$2.P$33
N$116: LED7.K(C) LED361.K(C) LED362.K(C) LED363.K(C) LED364.K(C) LED365.K(C) LED366.K(C) LED367.K(C) LED368.K(C) U$1.P$33
N$117: LED6.K(C) LED353.K(C) LED354.K(C) LED355.K(C) LED356.K(C) LED357.K(C) LED358.K(C) LED359.K(C) LED360.K(C) U$1.P$34
N$118: LED5.K(C) LED345.K(C) LED346.K(C) LED347.K(C) LED348.K(C) LED349.K(C) LED350.K(C) LED351.K(C) LED352.K(C) U$1.P$35
N$119: LED4.K(C) LED337.K(C) LED338.K(C) LED339.K(C) LED340.K(C) LED341.K(C) LED342.K(C) LED343.K(C) LED344.K(C) U$1.P$36
N$120: LED3.K(C) LED329.K(C) LED330.K(C) LED331.K(C) LED332.K(C) LED333.K(C) LED334.K(C) LED335.K(C) LED336.K(C) U$1.P$37
N$121: LED2.K(C) LED321.K(C) LED322.K(C) LED323.K(C) LED324.K(C) LED325.K(C) LED326.K(C) LED327.K(C) LED328.K(C) U$1.P$38
N$122: LED706.A LED714.A LED722.A LED730.A LED738.A LED746.A LED754.A LED762.A LED770.A LED778.A LED786.A LED794.A LED802.A LED810.A LED818.A LED826.A LED834.A LED842.A LED850.A LED858.A LED866.A LED874.A LED882.A LED890.A LED898.A LED906.A LED914.A LED922.A LED930.A LED938.A LED946.A LED954.A LED962.A LED970.A LED978.A LED986.A LED994.A LED1002.A LED1010.A U$3.P$5
N$123: LED707.A LED715.A LED723.A LED731.A LED739.A LED747.A LED755.A LED763.A LED771.A LED779.A LED787.A LED795.A LED803.A LED811.A LED819.A LED827.A LED835.A LED843.A LED851.A LED859.A LED867.A LED875.A LED883.A LED891.A LED899.A LED907.A LED915.A LED923.A LED931.A LED939.A LED947.A LED955.A LED963.A LED971.A LED979.A LED987.A LED995.A LED1003.A LED1011.A U$3.P$4
N$124: LED708.A LED716.A LED724.A LED732.A LED740.A LED748.A LED756.A LED764.A LED772.A LED780.A LED788.A LED796.A LED804.A LED812.A LED820.A LED828.A LED836.A LED844.A LED852.A LED860.A LED868.A LED876.A LED884.A LED892.A LED900.A LED908.A LED916.A LED924.A LED932.A LED940.A LED948.A LED956.A LED964.A LED972.A LED980.A LED988.A LED996.A LED1004.A LED1012.A U$3.P$3
N$125: LED709.A LED717.A LED725.A LED733.A LED741.A LED749.A LED757.A LED765.A LED773.A LED781.A LED789.A LED797.A LED805.A LED813.A LED821.A LED829.A LED837.A LED845.A LED853.A LED861.A LED869.A LED877.A LED885.A LED893.A LED901.A LED909.A LED917.A LED925.A LED933.A LED941.A LED949.A LED957.A LED965.A LED973.A LED981.A LED989.A LED997.A LED1005.A LED1013.A U$3.P$2
N$126: LED710.A LED718.A LED726.A LED734.A LED742.A LED750.A LED758.A LED766.A LED774.A LED782.A LED790.A LED798.A LED806.A LED814.A LED822.A LED830.A LED838.A LED846.A LED854.A LED862.A LED870.A LED878.A LED886.A LED894.A LED902.A LED910.A LED918.A LED926.A LED934.A LED942.A LED950.A LED958.A LED966.A LED974.A LED982.A LED990.A LED998.A LED1006.A LED1014.A U$3.P$1
N$127: LED1015.A LED1016.A LED1017.A LED1018.A LED1019.A LED1020.A LED1021.A LED1022.A LED1023.A LED1024.A LED1025.A LED1026.A LED1027.A LED1028.A LED1029.A LED1030.A LED1031.A LED1032.A LED1033.A LED1034.A LED1035.A LED1036.A LED1037.A LED1038.A LED1039.A LED1040.A LED1041.A LED1042.A LED1043.A LED1044.A LED1045.A LED1046.A LED1047.A LED1048.A LED1049.A LED1050.A LED1051.A LED1052.A LED1053.A U$3.P$9
N$128: LED703.K(C) LED704.K(C) LED705.K(C) LED706.K(C) LED707.K(C) LED708.K(C) LED709.K(C) LED710.K(C) LED1015.K(C) U$2.P$39
N$129: LED759.K(C) LED760.K(C) LED761.K(C) LED762.K(C) LED763.K(C) LED764.K(C) LED765.K(C) LED766.K(C) LED1022.K(C) U$2.P$32
N$130: LED775.K(C) LED776.K(C) LED777.K(C) LED778.K(C) LED779.K(C) LED780.K(C) LED781.K(C) LED782.K(C) LED1024.K(C) U$2.P$30
N$162: LED316.A LED324.A LED332.A LED340.A LED348.A LED356.A LED364.A LED372.A LED380.A LED388.A LED396.A LED404.A LED412.A LED420.A LED428.A LED436.A LED444.A LED452.A LED460.A LED468.A LED476.A LED484.A LED492.A LED500.A LED508.A LED516.A LED524.A LED532.A LED540.A LED548.A LED556.A LED564.A LED572.A LED580.A LED588.A LED596.A LED604.A LED612.A LED620.A U$4.P$5
N$163: LED317.A LED325.A LED333.A LED341.A LED349.A LED357.A LED365.A LED373.A LED381.A LED389.A LED397.A LED405.A LED413.A LED421.A LED429.A LED437.A LED445.A LED453.A LED461.A LED469.A LED477.A LED485.A LED493.A LED501.A LED509.A LED517.A LED525.A LED533.A LED541.A LED549.A LED557.A LED565.A LED573.A LED581.A LED589.A LED597.A LED605.A LED613.A LED621.A U$4.P$4
N$164: LED318.A LED326.A LED334.A LED342.A LED350.A LED358.A LED366.A LED374.A LED382.A LED390.A LED398.A LED406.A LED414.A LED422.A LED430.A LED438.A LED446.A LED454.A LED462.A LED470.A LED478.A LED486.A LED494.A LED502.A LED510.A LED518.A LED526.A LED534.A LED542.A LED550.A LED558.A LED566.A LED574.A LED582.A LED590.A LED598.A LED606.A LED614.A LED622.A U$4.P$3
N$165: LED319.A LED327.A LED335.A LED343.A LED351.A LED359.A LED367.A LED375.A LED383.A LED391.A LED399.A LED407.A LED415.A LED423.A LED431.A LED439.A LED447.A LED455.A LED463.A LED471.A LED479.A LED487.A LED495.A LED503.A LED511.A LED519.A LED527.A LED535.A LED543.A LED551.A LED559.A LED567.A LED575.A LED583.A LED591.A LED599.A LED607.A LED615.A LED623.A U$4.P$2
N$166: LED320.A LED328.A LED336.A LED344.A LED352.A LED360.A LED368.A LED376.A LED384.A LED392.A LED400.A LED408.A LED416.A LED424.A LED432.A LED440.A LED448.A LED456.A LED464.A LED472.A LED480.A LED488.A LED496.A LED504.A LED512.A LED520.A LED528.A LED536.A LED544.A LED552.A LED560.A LED568.A LED576.A LED584.A LED592.A LED600.A LED608.A LED616.A LED624.A U$4.P$1
SW4: LED705.A LED713.A LED721.A LED729.A LED737.A LED745.A LED753.A LED761.A LED769.A LED777.A LED785.A LED793.A LED801.A LED809.A LED817.A LED825.A LED833.A LED841.A LED849.A LED857.A LED865.A LED873.A LED881.A LED889.A LED897.A LED905.A LED913.A LED921.A LED929.A LED937.A LED945.A LED953.A LED961.A LED969.A LED977.A LED985.A LED993.A LED1001.A LED1009.A U$3.P$6
SW5: LED704.A LED712.A LED720.A LED728.A LED736.A LED744.A LED752.A LED760.A LED768.A LED776.A LED784.A LED792.A LED800.A LED808.A LED816.A LED824.A LED832.A LED840.A LED848.A LED856.A LED864.A LED872.A LED880.A LED888.A LED896.A LED904.A LED912.A LED920.A LED928.A LED936.A LED944.A LED952.A LED960.A LED968.A LED976.A LED984.A LED992.A LED1000.A LED1008.A U$3.P$7
SW6: LED315.A LED323.A LED331.A LED339.A LED347.A LED355.A LED363.A LED371.A LED379.A LED387.A LED395.A LED403.A LED411.A LED419.A LED427.A LED435.A LED443.A LED451.A LED459.A LED467.A LED475.A LED483.A LED491.A LED499.A LED507.A LED515.A LED523.A LED531.A LED539.A LED547.A LED555.A LED563.A LED571.A LED579.A LED587.A LED595.A LED603.A LED611.A LED619.A U$4.P$6
SW7: LED314.A LED322.A LED330.A LED338.A LED346.A LED354.A LED362.A LED370.A LED378.A LED386.A LED394.A LED402.A LED410.A LED418.A LED426.A LED434.A LED442.A LED450.A LED458.A LED466.A LED474.A LED482.A LED490.A LED498.A LED506.A LED514.A LED522.A LED530.A LED538.A LED546.A LED554.A LED562.A LED570.A LED578.A LED586.A LED594.A LED602.A LED610.A LED618.A U$4.P$7
SW8: LED313.A LED321.A LED329.A LED337.A LED345.A LED353.A LED361.A LED369.A LED377.A LED385.A LED393.A LED401.A LED409.A LED417.A LED425.A LED433.A LED441.A LED449.A LED457.A LED465.A LED473.A LED481.A LED489.A LED497.A LED505.A LED513.A LED521.A LED529.A LED537.A LED545.A LED553.A LED561.A LED569.A LED577.A LED585.A LED593.A LED601.A LED609.A LED617.A U$4.P$8
SW9: LED703.A LED711.A LED719.A LED727.A LED735.A LED743.A LED751.A LED759.A LED767.A LED775.A LED783.A LED791.A LED799.A LED807.A LED815.A LED823.A LED831.A LED839.A LED847.A LED855.A LED863.A LED871.A LED879.A LED887.A LED895.A LED903.A LED911.A LED919.A LED927.A LED935.A LED943.A LED951.A LED959.A LED967.A LED975.A LED983.A LED991.A LED999.A LED1007.A U$3.P$8
Unconnected: U$1.P$28

## Library data of the parts
LED1-LED39 LED313-LED624 LED703-LED1053 = SparkFun-LED:LED: LED (Generic) Standard schematic elements and footprints for 5mm, 3mm, 1206, and 0603 sized LEDs. Generic LEDs with no color specified.; PROD_ID: DIO-08794
U$1 U$2 = Terminals:39COLUMN
U$3 U$4 = Terminals:9ROW